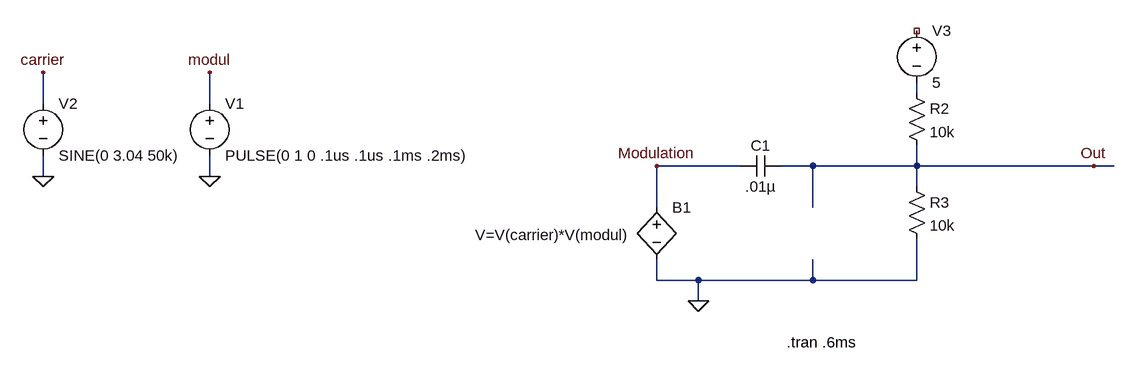
[diagram p0: schematic DCOffset1.asc]
DCOffset1.asc, the LTspice schematic file:
Version 4
SHEET 1 880 784
WIRE 400 384 400 368
WIRE -944 400 -944 352
WIRE -688 400 -688 352
WIRE 128 496 0 496
WIRE 240 496 192 496
WIRE 400 496 400 464
WIRE 400 496 240 496
WIRE 672 496 400 496
WIRE 704 496 672 496
WIRE -944 512 -944 480
WIRE -688 512 -688 480
WIRE 400 528 400 496
WIRE 0 560 0 496
WIRE 240 560 240 496
WIRE 0 672 0 640
WIRE 64 672 0 672
WIRE 240 672 240 640
WIRE 240 672 64 672
WIRE 400 672 400 608
WIRE 400 672 240 672
WIRE 64 704 64 672
FLAG -688 512 0
FLAG -944 512 0
FLAG -688 352 modul
FLAG -944 352 carrier
FLAG 64 704 0
FLAG 0 496 Modulation
FLAG 672 496 Out
DATAFLAG 0 560 "$"
SYMBOL voltage -688 384 R0
WINDOW 123 0 0 Left 0
WINDOW 39 0 0 Left 0
SYMATTR InstName V1
SYMATTR Value PULSE(0 1 0 .1us .1us .1ms .2ms)
SYMBOL voltage -944 384 R0
WINDOW 123 0 0 Left 0
WINDOW 39 0 0 Left 0
SYMATTR InstName V2
SYMATTR Value SINE(0 3.04 50k)
SYMBOL bv 0 544 R0
WINDOW 3 -279 58 Left 2
SYMATTR Value V=V(carrier)*V(modul)
SYMATTR InstName B1
SYMBOL cap 192 480 R90
WINDOW 0 0 32 VBottom 2
WINDOW 3 32 32 VTop 2
SYMATTR InstName C1
SYMATTR Value .01µ
SYMBOL res 384 368 R0
SYMATTR InstName R2
SYMATTR Value 10k
SYMBOL res 384 512 R0
SYMATTR InstName R3
SYMATTR Value 10k
SYMBOL voltage 400 272 R0
WINDOW 123 0 0 Left 0
WINDOW 39 0 0 Left 0
SYMATTR InstName V3
SYMATTR Value 5
TEXT 200 768 Left 2 !.tran .6ms

The netlist it stands for:
* DCOffset1.asc
V1 modul 0 PULSE(0 1 0 .1us .1us .1ms .2ms)
V2 carrier 0 SINE(0 3.04 50k)
B1 Modulation 0 V=V(carrier)*V(modul)
C1 Out Modulation .01µ
R2 N001 Out 10k
R3 Out 0 10k
V3 NC_01 N001 5
.tran .6ms
.backanno
.end

* Results of the author's LTspice run, read from the files saved beside the schematic
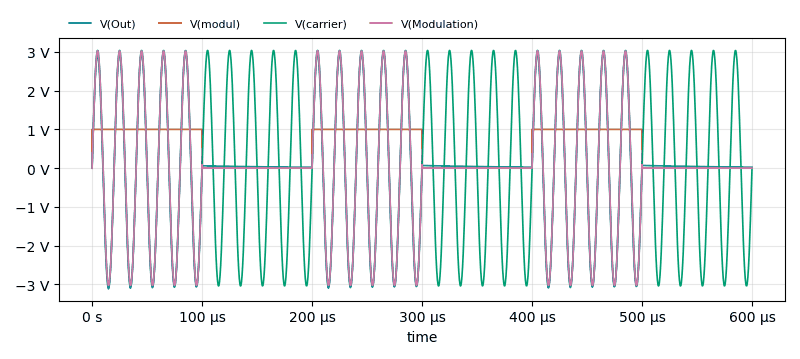
[diagram p1: Transient Analysis of DCOffset1.asc, plotted from the saved traces]
* Transient Analysis, 1 run:
*   V(Out): min -3.111 V, max 2.994 V, average -4.294 mV, rms 1.508 V, last 25.82 mV
*   V(modul): min 0 V, max 1 V, average 500.5 mV, rms 707.4 mV, last 0 V
*   V(carrier): min -3.039 V, max 3.039 V, average 8.449 µV, rms 2.15 V, last 0 V
*   V(Modulation): min -3.028 V, max 3.03 V, average 55.92 µV, rms 1.51 V, last 0 V